# Altium schematic sheet POEInjectorTop.SchDoc
size A
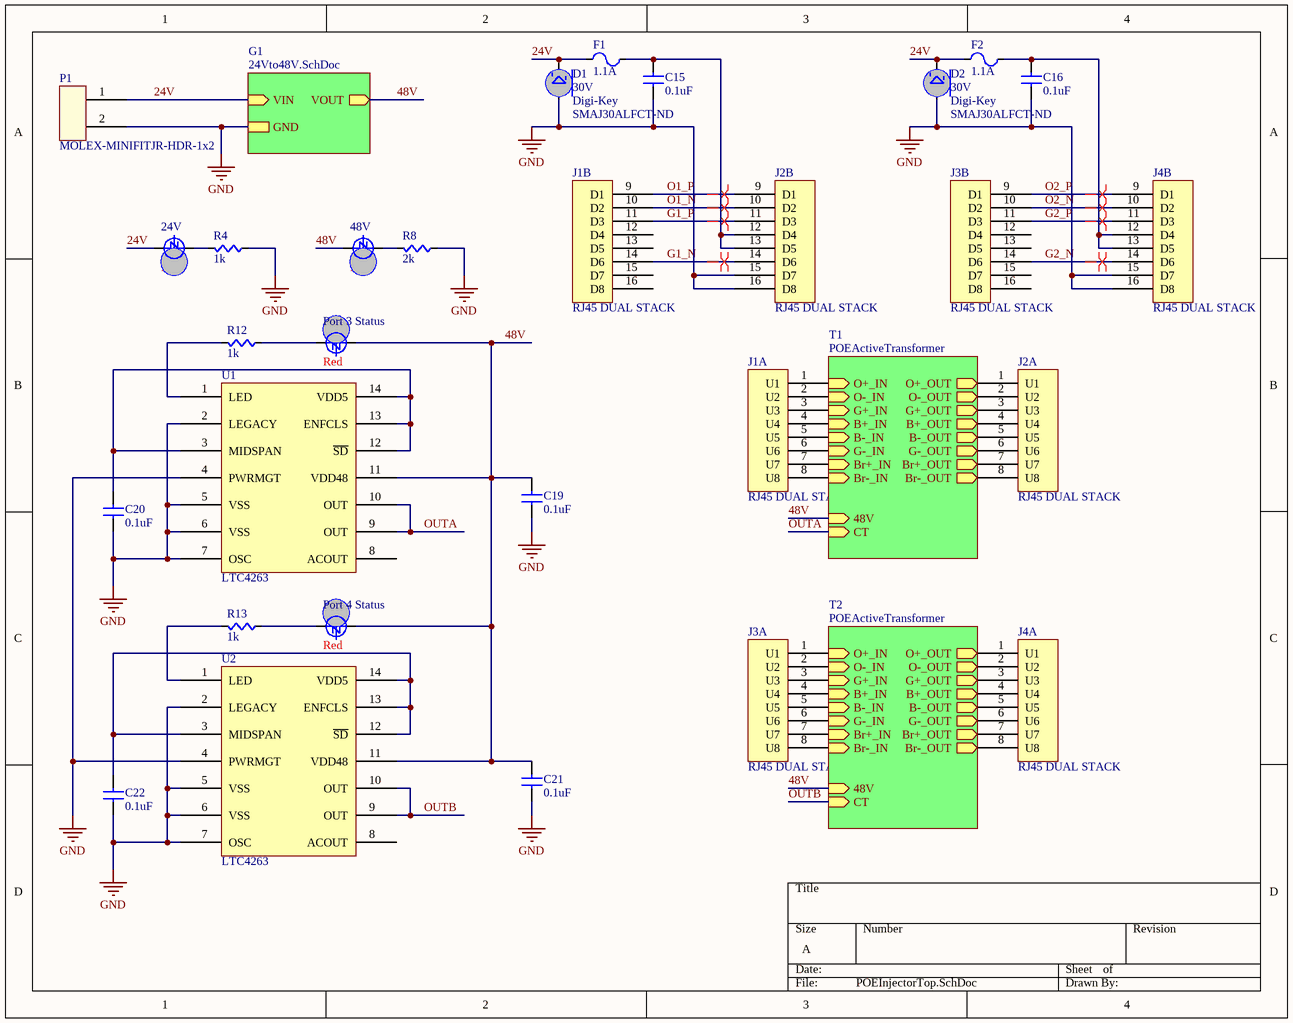
[diagram p0: POEInjectorTop.SchDoc]

## Parts
24V  Color: Red  [LED0603]  (hidden comment: LED)
48V  Color: Red  [LED0603]  (hidden comment: LED)
C15  value 0.1uF  [CAPC0603]  (hidden comment: Cap)
C16  value 0.1uF  [CAPC0603]  (hidden comment: Cap)
C19  value 0.1uF  [CAPC0603]  (hidden comment: Cap)
C20  value 0.1uF  [CAPC0603]  (hidden comment: Cap)
C21  value 0.1uF  [CAPC0603]  (hidden comment: Cap)
C22  value 0.1uF  [CAPC0603]  (hidden comment: Cap)
D1  value 30V  Supplier 1: Digi-Key  Supplier Part Number 1: SMAJ30ALFCT-ND  [SMASeries]  (hidden comment: Zener)
D2  value 30V  Supplier 1: Digi-Key  Supplier Part Number 1: SMAJ30ALFCT-ND  [SMASeries]  (hidden comment: Zener)
F1  value 1.1A  [PTC7451X11N]  (hidden comment: PTC Fuse)
F2  value 1.1A  [PTC7451X11N]  (hidden comment: PTC Fuse)
J1  RJ45 DUAL STACK  [RJ45 DUAL STACK]  (parts A,B of 2)
J2  RJ45 DUAL STACK  [RJ45 DUAL STACK]  (parts A,B of 2)
J3  RJ45 DUAL STACK  [RJ45 DUAL STACK]  (parts A,B of 2)
J4  RJ45 DUAL STACK  [RJ45 DUAL STACK]  (parts A,B of 2)
P1  MOLEX-MINIFITJR-HDR-1x2  [MOLEX-MINIFITJR-HDR-1x2]
Port_3_Status  Color: Red  [LED0603]  (hidden comment: LED)
Port_4_Status  Color: Red  [LED0603]  (hidden comment: LED)
R4  value 1k  [RES0603]  (hidden comment: Res)
R8  value 2k  [RES0603]  (hidden comment: Res)
R12  value 1k  [RES0603]  (hidden comment: Res)
R13  value 1k  [RES0603]  (hidden comment: Res)
U1  LTC4263  [LTC4263]
U2  LTC4263  [LTC4263]

## Sub-sheets
G1 = 24Vto48V.SchDoc: VIN (in), GND, VOUT (out)
T1 = POEActiveTransformer: O+_IN, O-_IN, G+_IN, B+_IN, B-_IN, G-_IN, Br+_IN, Br-_IN, O+_OUT, O-_OUT, G+_OUT, B+_OUT, B-_OUT, G-_OUT, Br+_OUT, Br-_OUT, 48V, CT
T2 = POEActiveTransformer: O+_IN, O-_IN, G+_IN, B+_IN, B-_IN, G-_IN, Br+_IN, Br-_IN, O+_OUT, O-_OUT, G+_OUT, B+_OUT, B-_OUT, G-_OUT, Br+_OUT, Br-_OUT, 48V, CT

## Nets
GND: C15.2(B) C16.2(B) C19.2(B) C20.2(B) C21.2(B) C22.2(B) D1.A D2.A J2.15(D7) J2.16(D8) J4.15(D7) J4.16(D8) P1.2 R4.2(B) R8.2(B) U1.2(LEGACY) U1.4(PWRMGT) U1.5(VSS) U1.6(VSS) U1.7(OSC) U2.2(LEGACY) U2.4(PWRMGT) U2.5(VSS) U2.6(VSS) U2.7(OSC) ; sheet G1/GND
24V: 24V.A D1.C D2.C F1.1(A) F2.1(A) P1.1 ; sheet G1/VIN
48V: 48V.A C19.1(A) C21.1(A) Port_3_Status.A Port_4_Status.A U1.11(VDD48) U2.11(VDD48) ; sheet G1/VOUT, sheet T1/48V, sheet T2/48V
G1_N: J1.14(D6) J2.14(D6)
G1_P: J1.11(D3) J2.11(D3)
G2_N: J3.14(D6) J4.14(D6)
G2_P: J3.11(D3) J4.11(D3)
O1_N: J1.10(D2) J2.10(D2)
O1_P: J1.9(D1) J2.9(D1)
O2_N: J3.10(D2) J4.10(D2)
O2_P: J3.9(D1) J4.9(D1)
OUTA: U1.9(OUT) U1.10(OUT) ; sheet T1/CT
OUTB: U2.9(OUT) U2.10(OUT) ; sheet T2/CT
Net24V_C: 24V.C R4.1(A)
Net48V_C: 48V.C R8.1(A)
NetC15_1: C15.1(A) F1.2(B) J2.12(D4) J2.13(D5)
NetC16_1: C16.1(A) F2.2(B) J4.12(D4) J4.13(D5)
NetC20_1: C20.1(A) U1.3(MIDSPAN) U1.12(~{SD}) U1.13(ENFCLS) U1.14(VDD5)
NetC22_1: C22.1(A) U2.3(MIDSPAN) U2.12(~{SD}) U2.13(ENFCLS) U2.14(VDD5)
NetJ1_1: J1.1(U1) ; sheet T1/O+_IN
NetJ1_2: J1.2(U2) ; sheet T1/O-_IN
NetJ1_3: J1.3(U3) ; sheet T1/G+_IN
NetJ1_4: J1.4(U4) ; sheet T1/B+_IN
NetJ1_5: J1.5(U5) ; sheet T1/B-_IN
NetJ1_6: J1.6(U6) ; sheet T1/G-_IN
NetJ1_7: J1.7(U7) ; sheet T1/Br+_IN
NetJ1_8: J1.8(U8) ; sheet T1/Br-_IN
NetJ2_1: J2.1(U1) ; sheet T1/O+_OUT
NetJ2_2: J2.2(U2) ; sheet T1/O-_OUT
NetJ2_3: J2.3(U3) ; sheet T1/G+_OUT
NetJ2_4: J2.4(U4) ; sheet T1/B+_OUT
NetJ2_5: J2.5(U5) ; sheet T1/B-_OUT
NetJ2_6: J2.6(U6) ; sheet T1/G-_OUT
NetJ2_7: J2.7(U7) ; sheet T1/Br+_OUT
NetJ2_8: J2.8(U8) ; sheet T1/Br-_OUT
NetJ3_1: J3.1(U1) ; sheet T2/O+_IN
NetJ3_2: J3.2(U2) ; sheet T2/O-_IN
NetJ3_3: J3.3(U3) ; sheet T2/G+_IN
NetJ3_4: J3.4(U4) ; sheet T2/B+_IN
NetJ3_5: J3.5(U5) ; sheet T2/B-_IN
NetJ3_6: J3.6(U6) ; sheet T2/G-_IN
NetJ3_7: J3.7(U7) ; sheet T2/Br+_IN
NetJ3_8: J3.8(U8) ; sheet T2/Br-_IN
NetJ4_1: J4.1(U1) ; sheet T2/O+_OUT
NetJ4_2: J4.2(U2) ; sheet T2/O-_OUT
NetJ4_3: J4.3(U3) ; sheet T2/G+_OUT
NetJ4_4: J4.4(U4) ; sheet T2/B+_OUT
NetJ4_5: J4.5(U5) ; sheet T2/B-_OUT
NetJ4_6: J4.6(U6) ; sheet T2/G-_OUT
NetJ4_7: J4.7(U7) ; sheet T2/Br+_OUT
NetJ4_8: J4.8(U8) ; sheet T2/Br-_OUT
NetPort_3_Status_C: Port_3_Status.C R12.2(B)
NetPort_4_Status_C: Port_4_Status.C R13.2(B)
NetR12_1: R12.1(A) U1.1(LED)
NetR13_1: R13.1(A) U2.1(LED)

Not connected (* = marked no-connect by the designer): J1 12(D4) 13(D5) 15(D7) 16(D8); J3 12(D4) 13(D5) 15(D7) 16(D8); U1 8(ACOUT); U2 8(ACOUT)

## Layout directives
differential pair: G1_N, G1_P, G2_N, G2_P, O1_N, O1_P, O2_N, O2_P

## Library data of the parts
D1 D2 = Zener: Zener Diode
F1 F2 = PTC_Fuse: Supplier 1: Digi-Key; Supplier Part Number 1: 507-1744-1-ND
J1-J4 = RJ45 DUAL STACK: CONN MOD JACK 8P8C R/A SHIELDED; Supplier 1: Digi-Key; Supplier Part Number 1: A31482-ND
P1 = MOLEX-MINIFITJR-HDR-1x2: MINIFITJRHDR VT DR O/PGS 2POS; Supplier 1: Digi-Key; Supplier Part Number 1: WM9814-ND
U1 U2 = LTC4263: IC POE 803.2AF SINGL PSE 14-SOIC; Supplier 1: Digi-Key; Supplier Part Number 1: LTC4263CS#PBF-ND
24V 48V Port_3_Status Port_4_Status = LED: Supplier 1: Digi-Key; Supplier Part Number 1: 754-1122-1-ND
C15 C16 C19-C22 = Cap: Supplier 1: Digi-Key
  C15 C16 C19 C21: Supplier Part Number 1: 1276-6807-1-ND
  C20 C22: Supplier Part Number 1: 1276-1000-1-ND
R4 R8 R12 R13 = Res: Supplier 1: Digi-Key
  R4 R12 R13: Supplier Part Number 1: RMCF0603JJ1K00CT-ND
  R8: Supplier Part Number 1: RMCF0603JT2K00CT-ND